# EAGLE design brain_rev_101 (EAGLE 6.3)
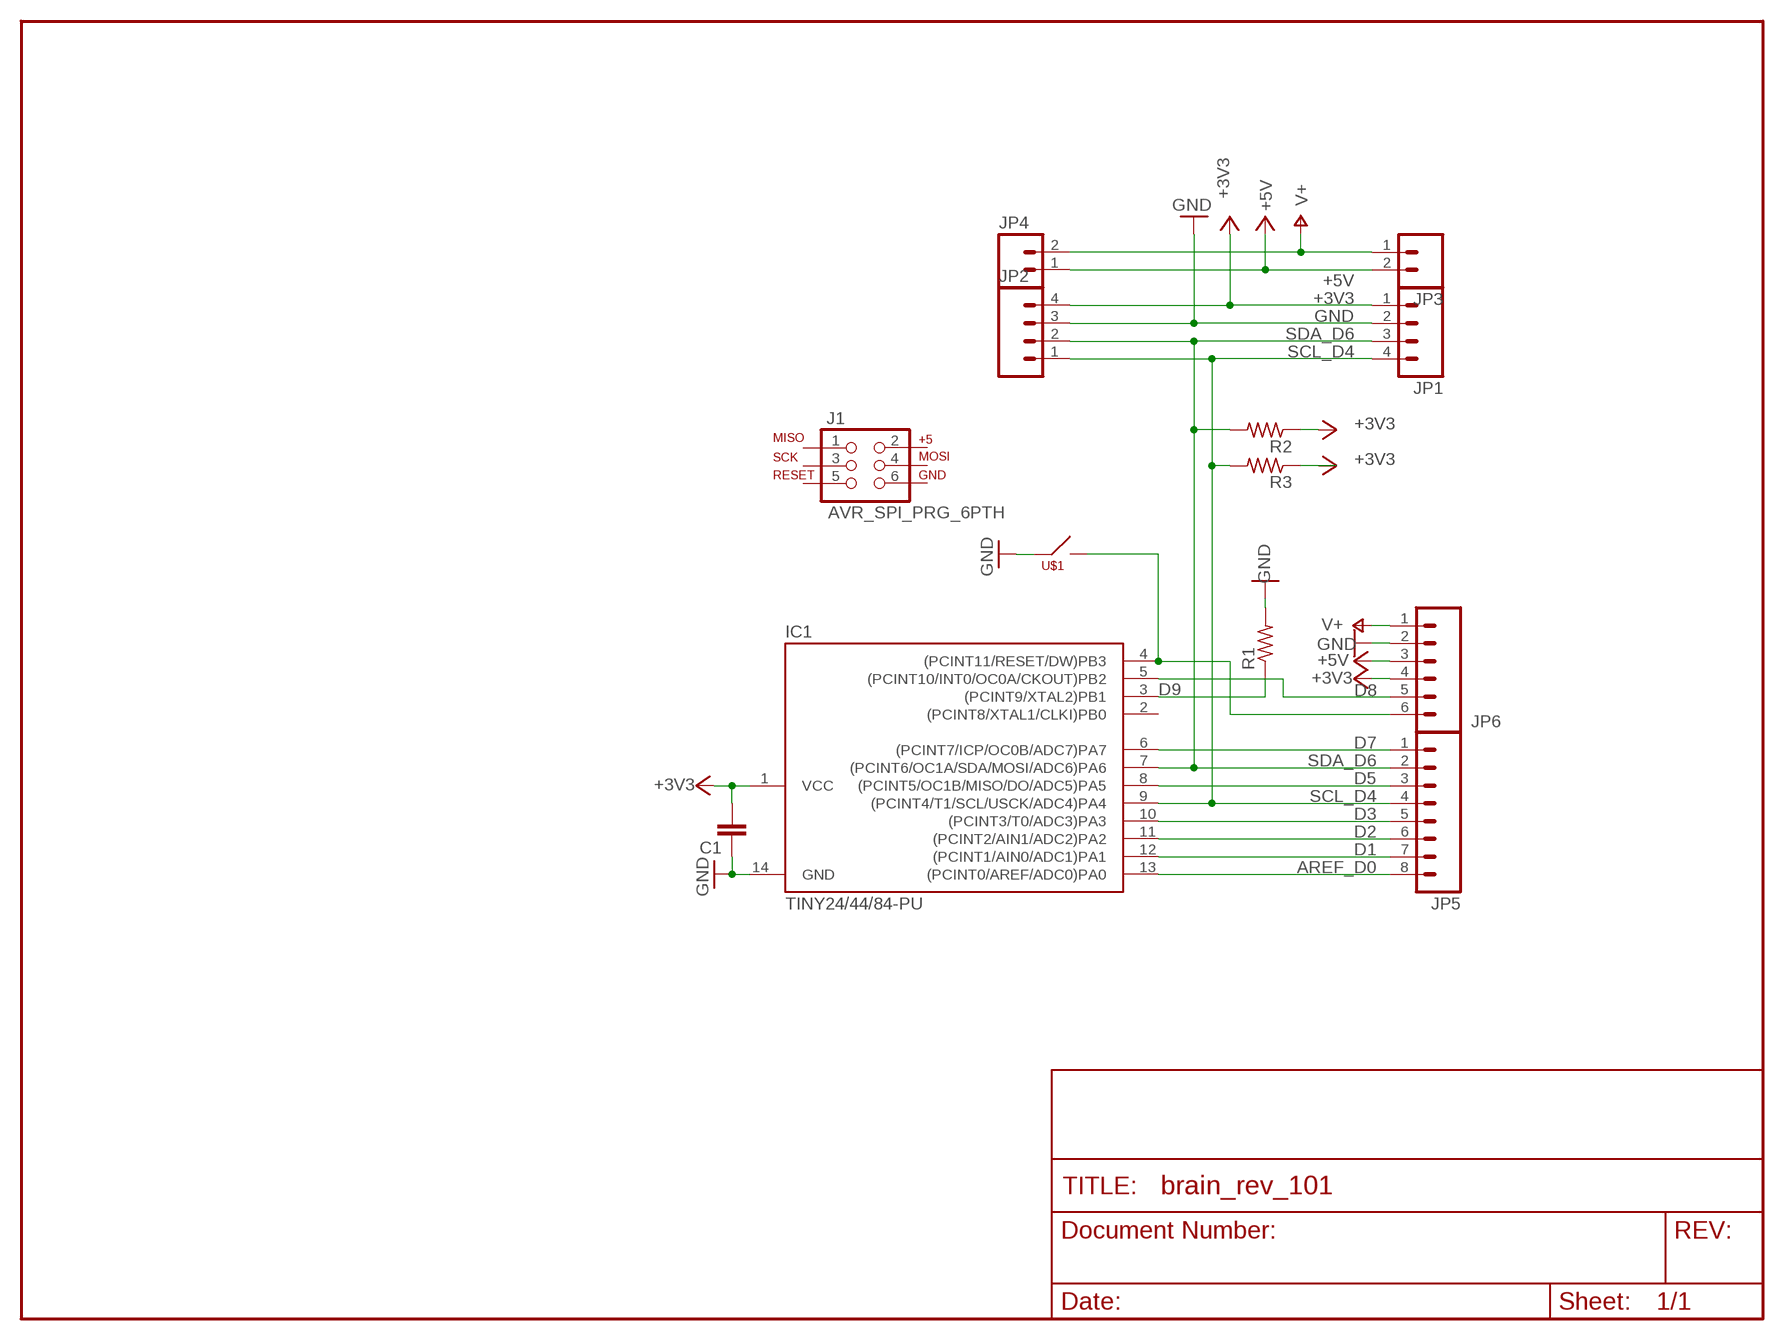
[diagram p0: schematic, sheet 1]

## Parts
C1  CAPKIT  [CAP-PTH-SMALL-KIT]
IC1  TINY24/44/84-PU  [DIL14]
J1  AVR_SPI_PRG_6PTH  [2X3]
JP1  M04PTH  [1X04]
JP2  M04PTH  [1X04]
JP3  M02PTH  [1X02]
JP4  M02PTH  [1X02]
JP5  M081X08  [1X08]
JP6  M06SIP  [1X06]
R1  R-US_0204/2V  [0204V]
R2  R-US_0204/2V  [0204V]
R3  R-US_0204/2V  [0204V]
U$1  PTS635_SWITCH  [PTS635_SWITCH]

## Nets
+3V3: C1.2 IC1.1(VCC) JP1.1 JP2.4 JP6.4 R2.1 R3.1
+5V: JP3.2 JP4.1 JP6.3
AREF_D0: IC1.13((PCINT0/AREF/ADC0)PA0) JP5.8
D1: IC1.12((PCINT1/AIN0/ADC1)PA1) JP5.7
D2: IC1.11((PCINT2/AIN1/ADC2)PA2) JP5.6
D3: IC1.10((PCINT3/T0/ADC3)PA3) JP5.5
D5: IC1.8((PCINT5/OC1B/MISO/DO/ADC5)PA5) JP5.3
D7: IC1.6((PCINT7/ICP/OC0B/ADC7)PA7) JP5.1
D8: IC1.5((PCINT10/INT0/OC0A/CKOUT)PB2) JP6.5
D9: IC1.3((PCINT9/XTAL2)PB1) R1.1
GND: C1.1 IC1.14(GND) JP1.2 JP2.3 JP6.2 R1.2 U$1.P$1
RESET: IC1.4((PCINT11/RESET/DW)PB3) JP6.6 U$1.P$2
SCL_D4: IC1.9((PCINT4/T1/SCL/USCK/ADC4)PA4) JP1.4 JP2.1 JP5.4 R3.2
SDA_D6: IC1.7((PCINT6/OC1A/SDA/MOSI/ADC6)PA6) JP1.3 JP2.2 JP5.2 R2.2
V+: JP3.1 JP4.2 JP6.1
Unconnected: IC1.2((PCINT8/XTAL1/CLKI)PB0) J1.1 J1.2 J1.3 J1.4 J1.5 J1.6

## Library data of the parts
C1 = SparkFun:CAP: Capacitor Standard 0603 ceramic capacitor, and 0.1" leaded capacitor.
IC1 = avr-7:TINY24/44/84
J1 = SparkFun_mod:AVR_SPI_PRG_6: AVR ISP 6 Pin This is the reduced ISP connector for AVR programming. Common on Arduino. This footprint will take up less PCB space and can be used with a 10-pin to 6-pin adapter such as SKU: BOB-08508
JP1 JP2 = SparkFun_mod:M04: Header 4 Standard 4-pin 0.1" header. Use with straight break away headers (SKU : PRT-00116), right angle break away headers (PRT-00553), swiss pins (PRT-00743), machine pins (PRT-00117), and female headers (PRT-00115). Molex polarized connector foot print use with SKU : PRT-08231 with associated crimp pins and housings. 1MM SMD Version SKU: PRT-10208
JP3 JP4 = SparkFun_mod:M02: Header 2 Standard 2-pin 0.1" header. Use with straight break away headers (SKU : PRT-00116), right angle break away headers (PRT-00553), swiss pins (PRT-00743), machine pins (PRT-00117), and female headers (PRT-00115). Molex polarized connector foot print use with SKU : PRT-08233 with associated crimp pins and housings.
JP5 = SparkFun_mod:M08: Header 8 Standard 8-pin 0.1" header. Use with straight break away headers (SKU : PRT-00116), right angle break away headers (PRT-00553), swiss pins (PRT-00743), machine pins (PRT-00117), and female headers (PRT-00115).
JP6 = SparkFun:M06: Header 6 Standard 6-pin 0.1" header. Use with straight break away headers (SKU : PRT-00116), right angle break away headers (PRT-00553), swiss pins (PRT-00743), machine pins (PRT-00117), and female headers (PRT-00115). Molex polarized connector foot print use with SKU : PRT-08094 with associated crimp pins and housings. NOTES ON THE VARIANTS LOCK and LOCK_LONGPADS... This footprint was designed to help hold the alignment of a through-hole component (i.e. 6-pin header) while soldering it into place. You may notice that each hole has been shifted either up or down by 0.005 of an inch from it's more standard position (which is a perfectly straight line). This slight alteration caused the pins (the squares in the middle) to touch the edges of the holes. Because they are alternating, it causes a "brace" to hold the component in place. 0.005 has proven to be the perfect amount of "off-center" position when using our standard breakaway headers. Although looks a little odd when you look at the bare footprint, once you have a header in there, the alteration is very hard to notice. Also, if you push a header all the way into place, it is covered up entirely on the bottom side. This idea of altering the position of holes to aid alignment will be further integrated into the Sparkfun Library for other footprints. It can help hold any component with 3 or more connection pins.
R1-R3 = adafruit_mod:R-US_: RESISTOR, American symbol
U$1 = _my-parts:PTS635_SWITCH: www.ck-components.com

## Board
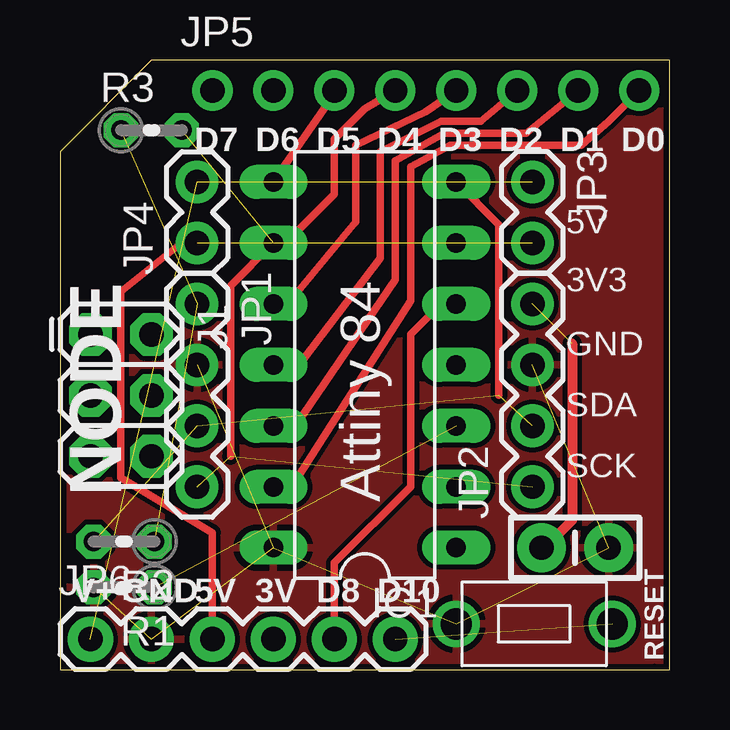
[diagram p1: board, top side]
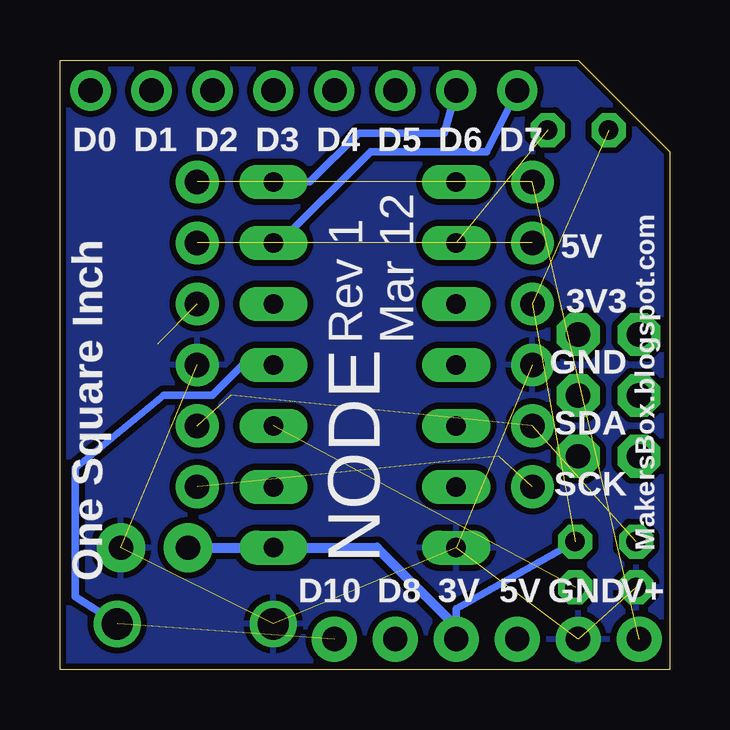
[diagram p2: board, bottom side, seen from below]

Size 25.4 x 25.4 mm. Coordinates in mm from the lower left corner, seen from the top.
Outline: 25.4,25.4 25.4,21.59 25.4,0 24.77,0 24.77,0 0,0 0,21.59
Outline: 25.4,25.4 3.81,25.4 0,21.59
Outline: 0,21.59 0,21.59
Copper layers (1*16): Top 0.035mm / dielectric 1.5mm / Bottom 0.035mm
Design rules "SparkFun": minimum track width 8mil, minimum drill 20mil, track to track 8mil, track to pad 8mil, pad to pad 8mil, via to via 8mil, smd to smd 8mil, copper to edge 10mil, drill to drill 8mil, minimum pad ring 12mil, minimum via ring 10mil, stop-mask expansion 4mil, vias tented up to drill 25mil, thermal gap 10mil

### Footprints (pad centres in the part's own frame; a part is rotated, then mirrored left to right if it is on the bottom)
CAP-PTH-SMALL-KIT = drill 1.016 pad 2.032: 1 -1.397,0; 2 1.397,0
DIL14 = drill 0.813 long: 1 -7.62,-3.81; 2 -5.08,-3.81; 3 -2.54,-3.81; 4 0,-3.81; 5 2.54,-3.81; 6 5.08,-3.81; 7 7.62,-3.81; 8 7.62,3.81; 9 5.08,3.81; 10 2.54,3.81; 11 0,3.81; 12 -2.54,3.81; 13 -5.08,3.81; 14 -7.62,3.81
2X3 = drill 1.016 pad 1.778 octagon: 1 0,0; 2 0,2.54; 3 2.54,0; 4 2.54,2.54; 5 5.08,0; 6 5.08,2.54
1X04 = drill 1.016 pad 1.778: 1 0,0; 2 2.54,0; 3 5.08,0; 4 7.62,0
1X02 = drill 1.016 pad 1.778: 1 0,0; 2 2.54,0
1X08 = drill 1.016 pad 1.676: 1 0,0; 2 2.54,0; 3 5.08,0; 4 7.62,0; 5 10.16,0; 6 12.7,0; 7 15.24,0; 8 17.78,0
1X06 = drill 1.016 pad 1.88: 1 0,0; 2 2.54,0; 3 5.08,0; 4 7.62,0; 5 10.16,0; 6 12.7,0
0204V = drill 0.813 octagon: 1 -1.27,0; 2 1.27,0
PTS635_SWITCH = drill 1.3: P$1 0,0; P$2 6.5,0

### Placement (x,y rotation side)
C1  21.46,5.08 180 top
IC1  12.7,12.7 90 top
J1  1.27,13.97 270 top
JP1  5.71,15.24 270 top
JP2  19.68,7.62 90 top
JP3  19.68,20.32 270 top
JP4  5.71,17.78 90 top
JP5  6.35,24.13 0 top
JP6  1.27,1.27 0 top
R1  2.67,3.43 180 top
R2  2.67,5.33 180 top
R3  3.81,22.48 0 top
U$1  16.51,1.91 0 top

### Tracks (layer width: path | path; a pad name or v marks a point on that pad's centre or on a via)
+3V3  (3 unrouted)
  Top 0.406: 21.34,13.59 21.34,6.22 20.19,5.08 C1.2
  Bottom 0.305: 8.89,1.78 8.89,2.54 R2.1
  Bottom 0.406: 19.68,5.08 C1.2 IC1.1 12.19,5.08 8.89,1.78 JP6.4
+5V  (1 unrouted)
  Top 0.305: JP6.3 6.35,5.71 2.54,8 2.54,15.75 5.08,17.78
  Top 0.406: 5.08,17.78 JP4.1
AREF_D0
  Top 0.305: JP5.8 22.86,22.86 21.72,21.84 16.26,21.84 14.61,20.95 14.61,15.37 9.65,7.62 IC1.13
D1
  Top 0.305: JP5.7 19.43,22.35 16,22.35 13.97,21.21 13.97,16.26 10.16,10.67 9.65,10.16 IC1.12
D2
  Top 0.305: JP5.6 17.53,22.86 15.88,22.86 13.34,21.59 13.34,17.14 10.16,12.95 9.91,12.7 IC1.11
D3
  Top 0.305: JP5.5 15.24,23.24 12.32,21.84 12.32,18.67 9.91,15.75 9.4,15.24 IC1.10
D5
  Top 0.305: JP5.3 11.18,23.62 IC1.8
D7
  Bottom 0.305: IC1.6 16.26,17.78 12.45,21.59 7.62,21.59 JP5.1
D8
  Top 0.305: IC1.5 15.88,15.24 14.61,13.97 14.61,7.62 11.43,4.45 JP6.5
D9  (1 unrouted)
GND  (6 unrouted)
  pour Bottom (isolate 0.254): -1.27,26.67 26.67,26.67 26.67,-1.27 -1.27,-1.27
  pour Top: -0.64,26.04 26.67,26.04 26.67,0 26.04,-0.64 -0.64,-0.64
RESET  (1 unrouted)
  Bottom 0.305: IC1.4 17.78,12.7 19.05,11.43 21.08,11.43 24.77,8.38 24.77,3.05 23.01,1.93 U$1.P$2
SCL_D4  (3 unrouted)
  Top 0.305: JP5.4 12.7,23.37 11.43,22.1 11.43,19.81 9.4,17.78 IC1.9 7.11,16 7.11,8.89
SDA_D6  (3 unrouted)
  Top 0.305: IC1.7 18.29,18.54 18.29,11.43
  Bottom 0.305: IC1.7 14.99,20.32 12.95,22.35 9.4,22.35 JP5.2
V+  (2 unrouted)

### Text on the board
tPlace: D7 | D6 | D5 | D4 | D3 | D2 | D1 | D0 | 5V | NODE | 3V3 | GND | SDA | SCK | Attiny 84 | V+ | GND | 5V | 3V | D8 | D10 | RESET
bPlace: D7 | D6 | D5 | D4 | D3 | D2 | D1 | D0 | 5V | 3V3 | Rev 1 / Mar 12 | GND | SDA | SCK | MakersBox.blogspot.com | NODE | One Square Inch | V+ | GND | 5V | 3V | D8 | D10